# EAGLE schematic L293D (EAGLE 9.4.1)
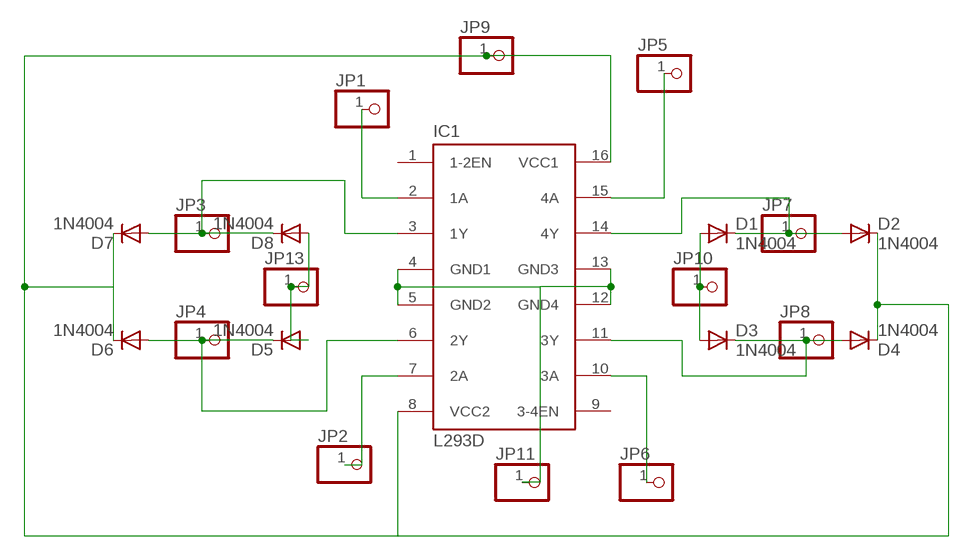
[diagram p0: schematic, sheet 1]

## Parts
D1  1N4004  [DO41-10]
D2  1N4004  [DO41-10]
D3  1N4004  [DO41-10]
D4  1N4004  [DO41-10]
D5  1N4004  [DO41-10]
D6  1N4004  [DO41-10]
D7  1N4004  [DO41-10]
D8  1N4004  [DO41-10]
IC1  L293D  [DIL16]
JP1  PINHD-1X1  [1X01]
JP2  PINHD-1X1  [1X01]
JP3  PINHD-1X1  [1X01]
JP4  PINHD-1X1  [1X01]
JP5  PINHD-1X1  [1X01]
JP6  PINHD-1X1  [1X01]
JP7  PINHD-1X1  [1X01]
JP8  PINHD-1X1  [1X01]
JP9  PINHD-1X1  [1X01]
JP10  PINHD-1X1  [1X01]
JP11  PINHD-1X1  [1X01]
JP13  PINHD-1X1  [1X01]

## Nets
+5V: D2.C D4.C IC1.8(VCC2) IC1.16(VCC1) JP9.1
E1: IC1.2(1A) JP1.1
GND: IC1.4(GND1) IC1.5(GND2) IC1.12(GND4) IC1.13(GND3) JP11.1
M1A: D7.A D8.C IC1.3(1Y) JP3.1
M1B: D5.C D6.A IC1.6(2Y) JP4.1
M2A: D1.C D2.A IC1.14(4Y) JP7.1
M2B: D3.C D4.A IC1.11(3Y) JP8.1
N$1: D5.A D8.A JP13.1
N$2: D1.A D3.A JP10.1
N$3: IC1.15(4A) JP5.1
N$6: IC1.10(3A) JP6.1
N$7: D6.C D7.C
N$11: IC1.7(2A) JP2.1
Unconnected: IC1.1(1-2EN) IC1.9(3-4EN)

## Library data of the parts
D1-D8 = adafruit:1N4004: DIODE General purpose 1N400x type rectifier (With bigger pads) http://www.ladyada.net/library/pcb/eaglelibrary.html
IC1 = st-microelectronics:L293D: PUSH-PULL 4 CHANNEL DRIVER; MPN: L293D; OC_FARNELL: 9589619; OC_NEWARK: 56P8249
JP1-JP11 JP13 = adafruit:PINHD-1X1: Pin header 1x1 for 0.1" spacing With round pins